# Altium project PoE_Base.PrjPcb
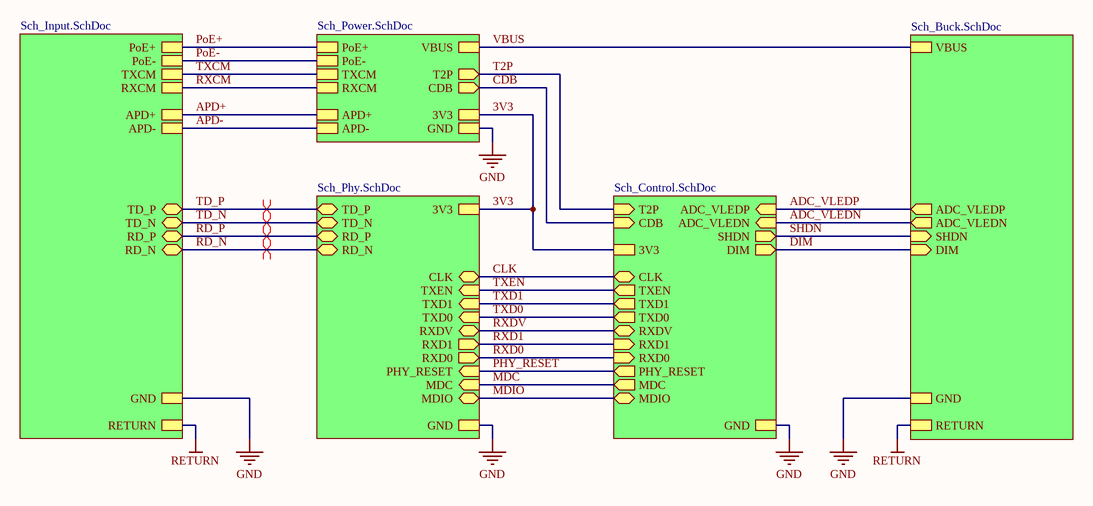
[diagram p0: Sch_TopLevel.SchDoc]
documentnumber: 1; Engineer1: Renan Duarte; Engineer2: André P.; Engineer3: Guilherme B.; Engineer4: Rafael B.; revision: 0; title: PoE Base Board
3 sheets, 31 parts. Net scope: hierarchical (ports join the sheet entries above them; power ports are global).
Board file: PCB_Base.PcbDoc
Sheets:
  Sch_TopLevel.SchDoc
    Sheet1 = Sch_Power.SchDoc
    Sheet4 = Sch_Control.SchDoc

## Sheet Sch_TopLevel.SchDoc: PoE Base Board
size A4; CompanyName: Universidade Federal de Santa Maria; Organization: Universidade Federal de Santa Maria; Address1: Av. Roraima 1000; Address2: Camobi; Address3: Santa Maria - RS; Address4: Brasil; SheetNumber: 1; SheetTotal: 6

### Sub-sheets
Sheet0 = Sch_Input.SchDoc (file not in this document): PoE+, PoE-, TXCM, RXCM, APD-, APD+, TD_P (bidir), TD_N (bidir), RD_P (bidir), RD_N (bidir), GND, RETURN
Sheet1 = Sch_Power.SchDoc: VBUS, PoE-, PoE+, RXCM, TXCM, T2P (out), CDB (out), 3V3, GND, APD-, APD+
Sheet2 = Sch_Buck.SchDoc (file not in this document): VBUS, ADC_VLEDP (out), ADC_VLEDN (out), SHDN (in), DIM (in), GND, RETURN
Sheet3 = Sch_Phy.SchDoc (file not in this document): RXD1 (out), RXD0 (out), PHY_RESET (in), MDC (in), MDIO (bidir), TD_P (bidir), TD_N (bidir), RD_P (bidir), RD_N (bidir), 3V3, RXDV (bidir), TXD0 (in), TXD1 (in), TXEN (in), CLK (bidir), GND
Sheet4 = Sch_Control.SchDoc: 3V3, T2P (in), CDB (in), ADC_VLEDP (in), ADC_VLEDN (in), SHDN (out), DIM (out), CLK (bidir), RXD1 (in), RXD0 (in), PHY_RESET (out), MDC (out), MDIO (bidir), RXDV (bidir), TXD0 (out), TXD1 (out), TXEN (out), GND

### Nets
3V3: sheet Sheet1/3V3, sheet Sheet4/3V3, sheet Sheet3/3V3
APD-: sheet Sheet1/GND, sheet Sheet1/APD-, sheet Sheet2/GND, sheet Sheet4/GND, sheet Sheet0/APD-, sheet Sheet0/GND, sheet Sheet3/GND  [also labelled GND]
RETURN: sheet Sheet2/RETURN, sheet Sheet0/RETURN
VBUS: sheet Sheet1/VBUS, sheet Sheet2/VBUS
ADC_VLEDN: sheet Sheet2/ADC_VLEDN, sheet Sheet4/ADC_VLEDN
ADC_VLEDP: sheet Sheet2/ADC_VLEDP, sheet Sheet4/ADC_VLEDP
APD+: sheet Sheet1/APD+, sheet Sheet0/APD+
CDB: sheet Sheet1/CDB, sheet Sheet4/CDB
CLK: sheet Sheet4/CLK, sheet Sheet3/CLK
DIM: sheet Sheet2/DIM, sheet Sheet4/DIM
MDC: sheet Sheet4/MDC, sheet Sheet3/MDC
MDIO: sheet Sheet4/MDIO, sheet Sheet3/MDIO
PHY_RESET: sheet Sheet4/PHY_RESET, sheet Sheet3/PHY_RESET
PoE+: sheet Sheet1/PoE+, sheet Sheet0/PoE+
PoE-: sheet Sheet1/PoE-, sheet Sheet0/PoE-
RD_N: sheet Sheet0/RD_N, sheet Sheet3/RD_N
RD_P: sheet Sheet0/RD_P, sheet Sheet3/RD_P
RXCM: sheet Sheet1/RXCM, sheet Sheet0/RXCM
RXD0: sheet Sheet4/RXD0, sheet Sheet3/RXD0
RXD1: sheet Sheet4/RXD1, sheet Sheet3/RXD1
RXDV: sheet Sheet4/RXDV, sheet Sheet3/RXDV
SHDN: sheet Sheet2/SHDN, sheet Sheet4/SHDN
T2P: sheet Sheet1/T2P, sheet Sheet4/T2P
TD_N: sheet Sheet0/TD_N, sheet Sheet3/TD_N
TD_P: sheet Sheet0/TD_P, sheet Sheet3/TD_P
TXCM: sheet Sheet1/TXCM, sheet Sheet0/TXCM
TXD0: sheet Sheet4/TXD0, sheet Sheet3/TXD0
TXD1: sheet Sheet4/TXD1, sheet Sheet3/TXD1
TXEN: sheet Sheet4/TXEN, sheet Sheet3/TXEN

### Layout directives
differential pair: RD_N, RD_P, TD_N, TD_P

### Notes on the sheet
- Engineers
- Title
- Size:
- Date:
- A4
- Number:
- Time:
- Revision:
- Sheet
- of
- File:

## Sheet Sch_Power.SchDoc: PoE Base Board
size A4; ENG_APP_DATE: --/--/--; DSN_APP_DATE: --/--/--; CHK_APP_DATE: --/--/--; CompanyName: Universidade Federal de Santa Maria; Organization: Universidade Federal de Santa Maria; Address1: Av. Roraima 1000; Address2: Camobi; Address3: Santa Maria - RS; Address4: Brasil; SheetNumber: 3; SheetTotal: 6
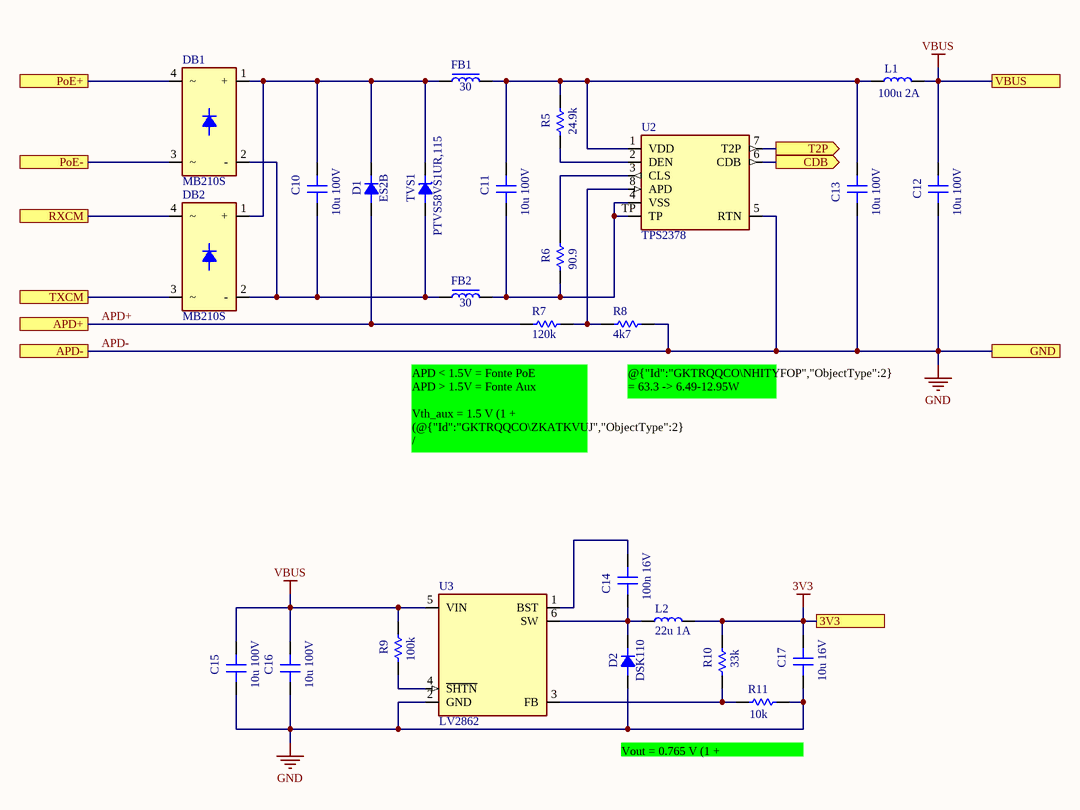
[diagram p1: Sch_Power.SchDoc]

### Parts
C10  10u 100V  [CAP_SMD_1210]
C11  10u 100V  [CAP_SMD_1210]
C12  10u 100V  [CAP_SMD_1210]
C13  10u 100V  [CAP_SMD_1210]
C14  100n 16V  [CAP_SMD_0603]
C15  10u 100V  [CAP_SMD_1210]
C16  10u 100V  [CAP_SMD_1210]
C17  10u 16V  [CAP_SMD_1210]
D1  ES2B  [D_SMA]
D2  DSK110  [D_SMD_SOD123W]
DB1  MB210S  [IC_MBS]
DB2  MB210S  [IC_MBS]
FB1  30  [FB_SMD_0805]
FB2  30  [FB_SMD_0805]
L1  100u 2A  [IND_SMD7.1x6.6x5]
L2  22u 1A  [IND_SMD3x3x1.2mm]
R5  24.9k  [RES_SMD_0603]
R6  90.9  [RES_SMD_0603]
R7  120k  [RES_SMD_0603]
R8  4k7  [RES_SMD_0603]
R9  100k  [RES_SMD_0603]
R10  33k  [RES_SMD_0603]
R11  10k  [RES_SMD_0603]
TVS1  PTVS58VS1UR,115  [D_SOD123W]
U2  TPS2378  [IC_SOIC8_TP]
U3  LV2862  [IC_SOT23_6]

### Ports
3V3, APD+, APD-, CDB (out), GND, PoE+, PoE-, RXCM, T2P (out), TXCM, VBUS

### Nets
3V3: C17.1 L2.2 R10.1 ; port 3V3
APD-: C12.2 C13.2 C15.2 C16.2 C17.2 D2.A R8.2 R11.2 U2.5(RTN) U3.2(GND) ; port APD-, port GND  [also labelled GND]
VBUS: C12.1 C15.1 C16.1 L1.2 R9.1 U3.5(VIN) ; port VBUS
APD+: D1.A R7.1 ; port APD+
CDB: U2.6(CDB) ; port CDB
PoE+: DB1.4 ; port PoE+
PoE-: DB1.3 ; port PoE-
RXCM: DB2.4 ; port RXCM
T2P: U2.7(T2P) ; port T2P
TXCM: DB2.3 ; port TXCM
NetC10_1: C10.1 D1.K DB1.1(+) DB2.1(+) FB1.1 TVS1.K
NetC10_2: C10.2 DB1.2(-) DB2.2(-) FB2.1 TVS1.A
NetC11_1: C11.1 C13.1 FB1.2 L1.1 R5.1 U2.1(VDD)
NetC11_2: C11.2 FB2.2 R6.2 U2.4(VSS) U2.TP
NetC14_1: C14.1 U3.1(BST)
NetC14_2: C14.2 D2.K L2.1 U3.6(SW)
NetR5_2: R5.2 U2.2(DEN)
NetR6_1: R6.1 U2.3(CLS)
NetR7_2: R7.2 R8.1 U2.8(APD)
NetR9_2: R9.2 U3.4(~{SHTN})
NetR10_2: R10.2 R11.1 U3.3(FB)

### Notes on the sheet
- (near R8) @{"Id":"GKTRQQCO\NHITYFOP","ObjectType":2} = 63.3 -> 6.49-12.95W
  @{"Id":"GKTRQQCO\NHITYFOP","ObjectType":2} = 90.9 -> 12.95-25.5W
- APD < 1.5V = Fonte PoE
  APD > 1.5V = Fonte Aux
  Vth_aux = 1.5 V (1 + (@{"Id":"GKTRQQCO\ZKATKVUJ","ObjectType":2} / @{"Id":"GKTRQQCO\COZMLFHK","ObjectType":2}))
  Vth_aux = 39.8V
- (near R11) Vout = 0.765 V (1 + (@{"Id":"GKTRQQCO\DMOJSVDS","ObjectType":2} / @{"Id":"GKTRQQCO\RENRJCZA","ObjectType":2}))
- Engineers
- Title
- Size:
- Date:
- A4
- Number:
- Time:
- Revision:
- Sheet
- of
- File:

### Library data of the parts
C10-C17 = CAP_SMD: Capacitor SMD - Generic
D1 = ES1J: 100V 2A Super Fast Recovery Rectifier; Datasheet: https://www.onsemi.com/download/data-sheet/pdf/es1j-d.pdf
D2 = DIODE_SMD: 100V 1A Schottky Barrier Diode
DB1 DB2 = MB2S: 100 2A diode bridge; MF: Fortune Semiconductor; MP: DW01A; SnapEDA_Link: https://www.snapeda.com/parts/DW01A/Fortune+Semiconductor/view-part/?ref=snap; Package: SOT-23-6 Fortune Semiconductor; Value: *; Check_prices: https://www.snapeda.com/parts/DW01A/Fortune+Semiconductor/view-part/?ref=eda
FB1 FB2 = FB_SMD: Ferrite bead SMD - Generic
L1 L2 = IND_SMD: Inductor SMD - Generic
R5-R11 = RES_SMD: Resistor SMD - Generic
TVS1 = ZENER_SMD: SMD zener diode - Generic
U2 = TPS2378: IEEE 802.3at PoE High-Power PD Interface; MF: Fortune Semiconductor; MP: DW01A; SnapEDA_Link: https://www.snapeda.com/parts/DW01A/Fortune+Semiconductor/view-part/?ref=snap; Package: SOT-23-6 Fortune Semiconductor; Value: *; Check_prices: https://www.snapeda.com/parts/DW01A/Fortune+Semiconductor/view-part/?ref=eda
U3 = LV2862: Buck converter controller; Datasheet: https://www.littelfuse.com/assetdocs/littelfuse-integrated-circuits-mxhv9910-datasheet?assetguid=0135616d-093f-45d8-8766-b0e533f2ef99

## Sheet Sch_Control.SchDoc: PoE Base Board
size A4; ENG_APP_DATE: --/--/--; DSN_APP_DATE: --/--/--; CHK_APP_DATE: --/--/--; CompanyName: Universidade Federal de Santa Maria; Organization: Universidade Federal de Santa Maria; Address1: Av. Roraima 1000; Address2: Camobi; Address3: Santa Maria - RS; Address4: Brasil; SheetNumber: 6; SheetTotal: 6
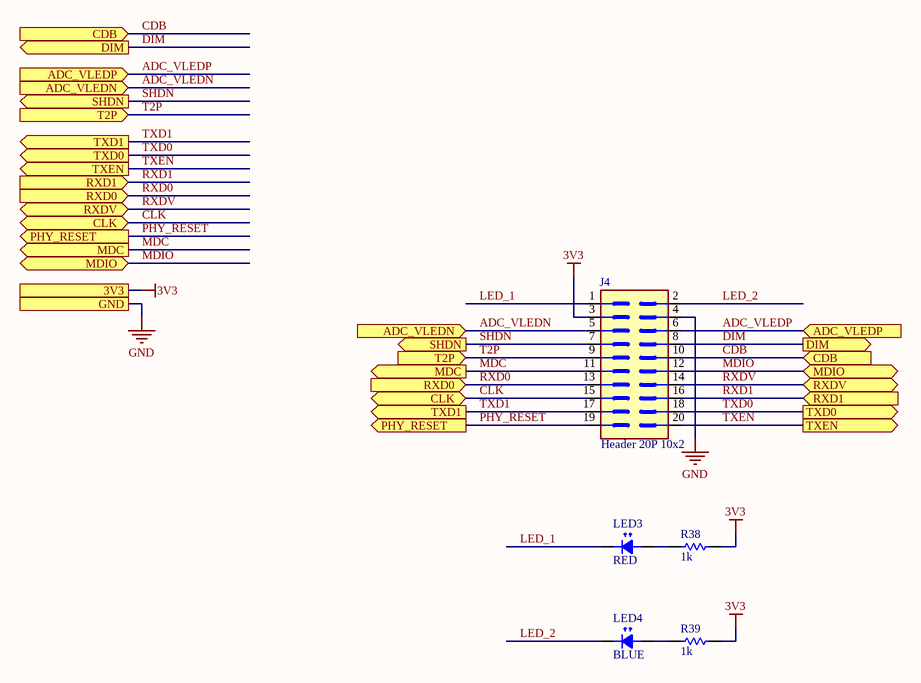
[diagram p2: Sch_Control.SchDoc]

### Parts
J4  Header 20P 10x2  [CON_PTH_20P_HEADER_10x2_2.54mm_FEMALE]
LED3  RED  [LED_SMD_0603]
LED4  BLUE  [LED_SMD_0603]
R38  1k  [RES_SMD_0603]
R39  1k  [RES_SMD_0603]

### Ports
3V3, ADC_VLEDN (in), ADC_VLEDP (in), CDB (in), CLK (bidir), DIM (out), GND, MDC (out), MDIO (bidir), PHY_RESET (out), RXD0 (in), RXD1 (in), RXDV (bidir), SHDN (out), T2P (in), TXD0 (out), TXD1 (out), TXEN (out)

### Nets
3V3: J4.3 R38.1 R39.1 ; port 3V3
GND: J4.4 ; port GND  [project net APD-]
ADC_VLEDN: J4.5 ; port ADC_VLEDN
ADC_VLEDP: J4.6 ; port ADC_VLEDP
CDB: J4.10 ; port CDB
CLK: J4.15 ; port CLK
DIM: J4.8 ; port DIM
LED_1: J4.1 LED3.K
LED_2: J4.2 LED4.K
MDC: J4.11 ; port MDC
MDIO: J4.12 ; port MDIO
PHY_RESET: J4.19 ; port PHY_RESET
RXD0: J4.13 ; port RXD0
RXD1: J4.16 ; port RXD1
RXDV: J4.14 ; port RXDV
SHDN: J4.7 ; port SHDN
T2P: J4.9 ; port T2P
TXD0: J4.18 ; port TXD0
TXD1: J4.17 ; port TXD1
TXEN: J4.20 ; port TXEN
NetLED3_A: LED3.A R38.2
NetLED4_A: LED4.A R39.2

### Notes on the sheet
- Engineers
- Title
- Size:
- Date:
- A4
- Number:
- Time:
- Revision:
- Sheet
- of
- File:

### Library data of the parts
J4 = CON_PTH_HEADER_20P_10x2: 10x2 20P PTH pin header - Generic
LED3 LED4 = LED_SMD: LED SMD - Generic
R38 R39 = RES_SMD: Resistor SMD - Generic

## Nets that join several sheets
3V3: Sch_Power (C17.1 L2.2 R10.1), Sch_Control (J4.3 R38.1 R39.1)
APD-: Sch_Power (10 pins), Sch_Control (J4.4)
CDB: Sch_Power (U2.6), Sch_Control (J4.10)
T2P: Sch_Power (U2.7), Sch_Control (J4.9)